# Altium schematic sheet SAST_PCB_V2B_Test_Beta_Sensors.SchDoc
size A2; SheetNumber: 1; SheetTotal: 1
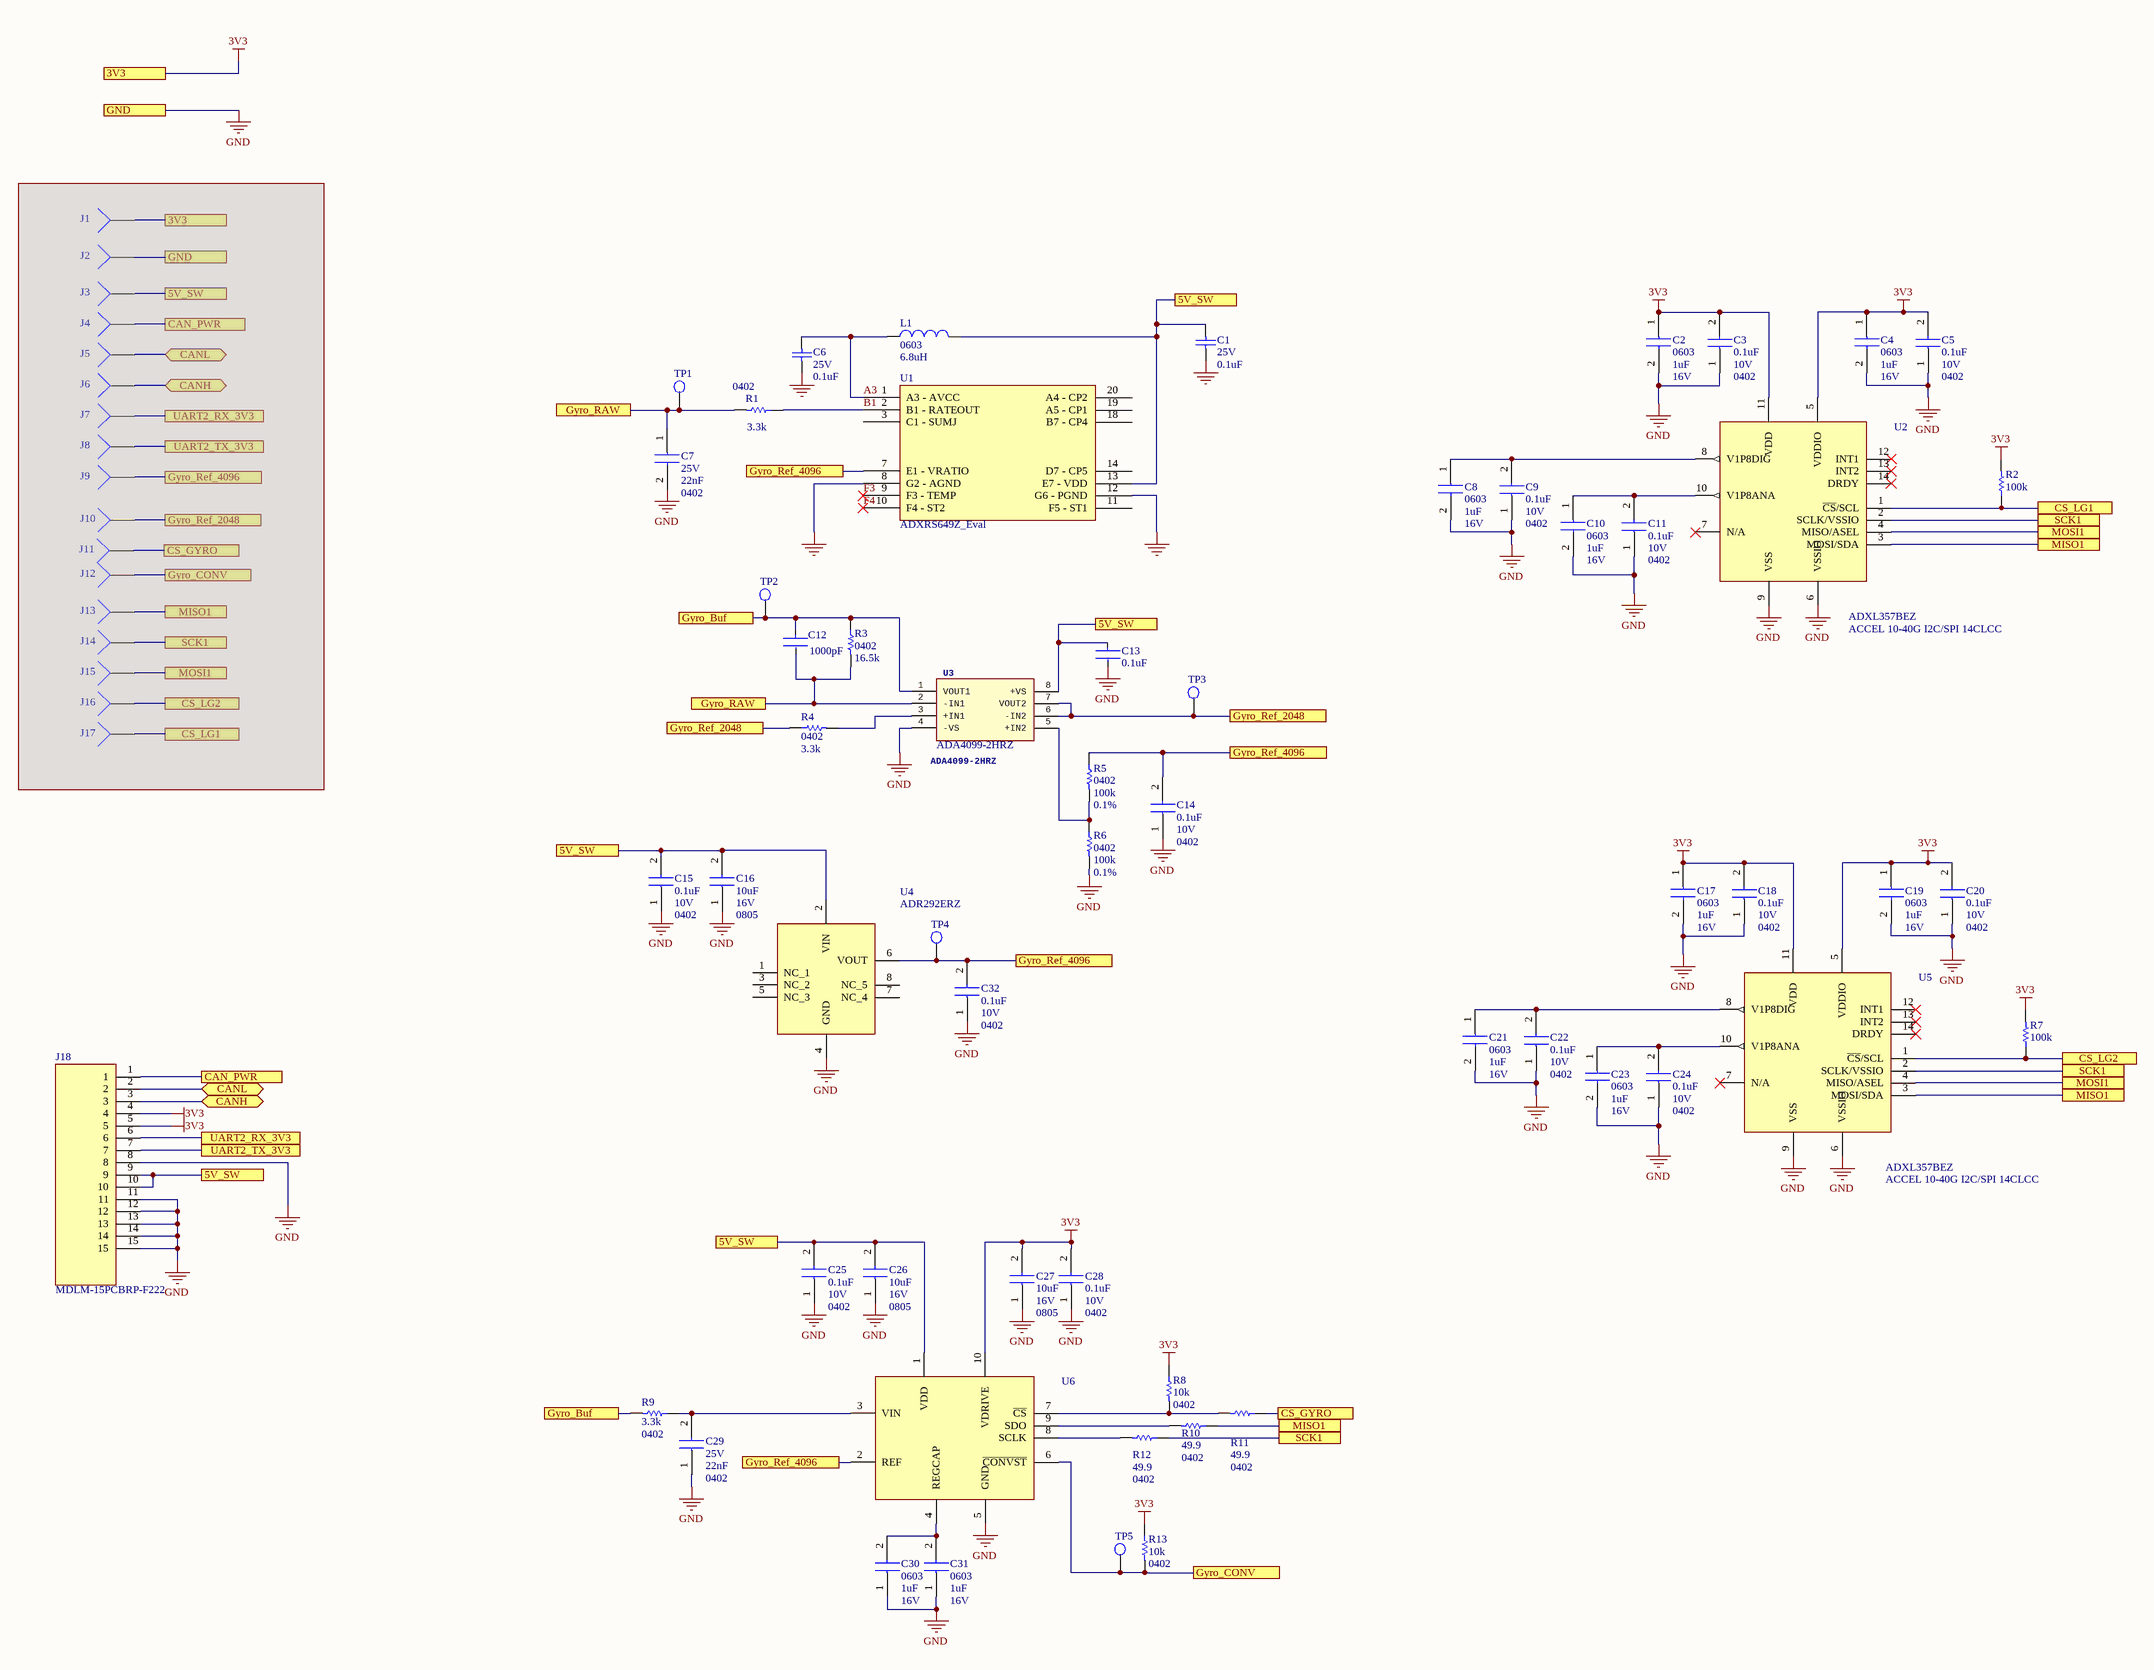
[diagram p0: SAST_PCB_V2B_Test_Beta_Sensors.SchDoc]

## Parts
C1  25V  value 0.1uF  [0402_DSP]
C2  value 1uF  Case/Package: 0603  Voltage: 16V  [0603_DSP]  (hidden comment: CAP CER 1UF 16V X8L 0603)
C3  value 0.1uF  Voltage: 10V  Case/Package: 0402  [0402_DSP]  (hidden comment: CAP CER .1UF 10V X8M 0201)
C4  value 1uF  Case/Package: 0603  Voltage: 16V  [0603_DSP]  (hidden comment: CAP CER 1UF 16V X8L 0603)
C5  value 0.1uF  Voltage: 10V  Case/Package: 0402  [0402_DSP]  (hidden comment: CAP CER .1UF 10V X8M 0201)
C6  25V  value 0.1uF  [0402_DSP]
C7  value 22nF  Voltage: 25V  Case/Package: 0402  [0402_DSP]  (hidden comment: CAP CER 0.022UF 25V X8R 0402)
C8  value 1uF  Case/Package: 0603  Voltage: 16V  [0603_DSP]  (hidden comment: CAP CER 1UF 16V X8L 0603)
C9  value 0.1uF  Voltage: 10V  Case/Package: 0402  [0402_DSP]  (hidden comment: CAP CER .1UF 10V X8M 0201)
C10  value 1uF  Case/Package: 0603  Voltage: 16V  [0603_DSP]  (hidden comment: CAP CER 1UF 16V X8L 0603)
C11  value 0.1uF  Voltage: 10V  Case/Package: 0402  [0402_DSP]  (hidden comment: CAP CER .1UF 10V X8M 0201)
C12  value 1000pF  [FP-GCM155-0_05-IPC_B]  (hidden comment: GCM155L81E104KE02D)
C13  value 0.1uF  [FP-GCM155-0_05-IPC_B]  (hidden comment: GCM155L81E104KE02D)
C14  value 0.1uF  Voltage: 10V  Case/Package: 0402  [0402_DSP]  (hidden comment: CAP CER .1UF 10V X8M 0201)
C15  value 0.1uF  Voltage: 10V  Case/Package: 0402  [0402_DSP]  (hidden comment: CAP CER .1UF 10V X8M 0201)
C16  value 10uF  Voltage: 16V  Case/Package: 0805  [CAPC2012X140N]  (hidden comment: CAP CER 10UF 16V X8M 0805)
C17  value 1uF  Case/Package: 0603  Voltage: 16V  [0603_DSP]  (hidden comment: CAP CER 1UF 16V X8L 0603)
C18  value 0.1uF  Voltage: 10V  Case/Package: 0402  [0402_DSP]  (hidden comment: CAP CER .1UF 10V X8M 0201)
C19  value 1uF  Case/Package: 0603  Voltage: 16V  [0603_DSP]  (hidden comment: CAP CER 1UF 16V X8L 0603)
C20  value 0.1uF  Voltage: 10V  Case/Package: 0402  [0402_DSP]  (hidden comment: CAP CER .1UF 10V X8M 0201)
C21  value 1uF  Case/Package: 0603  Voltage: 16V  [0603_DSP]  (hidden comment: CAP CER 1UF 16V X8L 0603)
C22  value 0.1uF  Voltage: 10V  Case/Package: 0402  [0402_DSP]  (hidden comment: CAP CER .1UF 10V X8M 0201)
C23  value 1uF  Case/Package: 0603  Voltage: 16V  [0603_DSP]  (hidden comment: CAP CER 1UF 16V X8L 0603)
C24  value 0.1uF  Voltage: 10V  Case/Package: 0402  [0402_DSP]  (hidden comment: CAP CER .1UF 10V X8M 0201)
C25  value 0.1uF  Voltage: 10V  Case/Package: 0402  [0402_DSP]  (hidden comment: CAP CER .1UF 10V X8M 0201)
C26  value 10uF  Voltage: 16V  Case/Package: 0805  [CAPC2012X140N]  (hidden comment: CAP CER 10UF 16V X8M 0805)
C27  value 10uF  Voltage: 16V  Case/Package: 0805  [CAPC2012X140N]  (hidden comment: CAP CER 10UF 16V X8M 0805)
C28  value 0.1uF  Voltage: 10V  Case/Package: 0402  [0402_DSP]  (hidden comment: CAP CER .1UF 10V X8M 0201)
C29  value 22nF  Voltage: 25V  Case/Package: 0402  [0402_DSP]  (hidden comment: CAP CER 0.022UF 25V X8R 0402)
C30  value 1uF  Case/Package: 0603  Voltage: 16V  [0603_DSP]  (hidden comment: CAP CER 1UF 16V X8L 0603)
C31  value 1uF  Case/Package: 0603  Voltage: 16V  [0603_DSP]  (hidden comment: CAP CER 1UF 16V X8L 0603)
C32  value 0.1uF  Voltage: 10V  Case/Package: 0402  [0402_DSP]  (hidden comment: CAP CER .1UF 10V X8M 0201)
J1  (no value)  [Wire24Awg2x1HPAD]
J2  (no value)  [Wire24Awg2x1HPAD]
J3  (no value)  [Wire24Awg2x1HPAD]
J4  (no value)  [Wire24Awg2x1HPAD]
J5  (no value)  [Wire24Awg2x1HPAD]
J6  (no value)  [Wire24Awg2x1HPAD]
J7  (no value)  [Wire24Awg2x1HPAD]
J8  (no value)  [Wire24Awg2x1HPAD]
J9  (no value)  [Wire24Awg2x1HPAD]
J10  (no value)  [Wire24Awg2x1HPAD]
J11  (no value)  [Wire24Awg2x1HPAD]
J12  (no value)  [Wire24Awg2x1HPAD]
J13  (no value)  [Wire24Awg2x1HPAD]
J14  (no value)  [Wire24Awg2x1HPAD]
J15  (no value)  [Wire24Awg2x1HPAD]
J16  (no value)  [Wire24Awg2x1HPAD]
J17  (no value)  [Wire24Awg2x1HPAD]
J18  MDLM-15PCBRP-F222  [MDLM-15PCBRP-F222]
L1  value 6.8uH  PackageReference: 0603  [0603_DSP]  (hidden comment: Inductor)
R1  value 3.3k  Case/Package: 0402  [0402_DSP]
R2  value 100k  [0402_DSP]
R3  0402  value 16.5k  [0402_DSP]
R4  0402  value 3.3k  [0402_DSP]
R5  0402  value 100k  Tolerance: 0.1%  [0402_DSP]
R6  0402  value 100k  Tolerance: 0.1%  [0402_DSP]
R7  value 100k  [0402_DSP]
R8  value 10k  Case/Package: 0402  [0402_DSP]
R9  value 3.3k  Case/Package: 0402  [0402_DSP]
R10  value 49.9  Case/Package: 0402  [0402_DSP]
R11  value 49.9  Case/Package: 0402  [0402_DSP]
R12  value 49.9  Case/Package: 0402  [0402_DSP]
R13  value 10k  Case/Package: 0402  [0402_DSP]
TP1  (no value)  [TestPoint_4952]
TP2  (no value)  [TestPoint_4952]
TP3  (no value)  [TestPoint_4952]
TP4  (no value)  [TestPoint_4952]
TP5  (no value)  [TestPoint_4952]
U1  ADXRS649Z_Eval  [ADXRS649Z_Eval]
U2  ACCEL 10-40G I2C/SPI 14CLCC  [ADXL355BEZ]
U3  ADA4099-2HRZ  [SOIC127P600X175-8N]
U4  ADR292ERZ  [SOIC127P600X175-8N]
U5  ACCEL 10-40G I2C/SPI 14CLCC  [ADXL355BEZ]
U6  IC ADC 12BIT SAR 10MSOP  [SOP50P490X110-10N]  (value not drawn)

## Ports
3V3 (see SAST_PCB_V2B_Test_Beta_Sensors[1A]), 5V_SW (see SAST_PCB_V2B_Test_Beta_Sensors[1A], SAST_PCB_V2B_Test_Beta_Sensors[1C], SAST_PCB_V2B_Test_Beta_Sensors[2B], SAST_PCB_V2B_Test_Beta_Sensors[3C], SAST_PCB_V2B_Test_Beta_Sensors[4A]), 5V_SW (see SAST_PCB_V2B_Test_Beta_Sensors[1A], SAST_PCB_V2B_Test_Beta_Sensors[1C], SAST_PCB_V2B_Test_Beta_Sensors[2B], SAST_PCB_V2B_Test_Beta_Sensors[3C], SAST_PCB_V2B_Test_Beta_Sensors[4B]), 5V_SW (see SAST_PCB_V2B_Test_Beta_Sensors[1A], SAST_PCB_V2B_Test_Beta_Sensors[1C], SAST_PCB_V2B_Test_Beta_Sensors[2B], SAST_PCB_V2B_Test_Beta_Sensors[4A], SAST_PCB_V2B_Test_Beta_Sensors[4B]), 5V_SW (see SAST_PCB_V2B_Test_Beta_Sensors[1A], SAST_PCB_V2B_Test_Beta_Sensors[1C], SAST_PCB_V2B_Test_Beta_Sensors[3C], SAST_PCB_V2B_Test_Beta_Sensors[4A], SAST_PCB_V2B_Test_Beta_Sensors[4B]), 5V_SW (see SAST_PCB_V2B_Test_Beta_Sensors[1A], SAST_PCB_V2B_Test_Beta_Sensors[2B], SAST_PCB_V2B_Test_Beta_Sensors[3C], SAST_PCB_V2B_Test_Beta_Sensors[4A], SAST_PCB_V2B_Test_Beta_Sensors[4B]), 5V_SW (see SAST_PCB_V2B_Test_Beta_Sensors[1C], SAST_PCB_V2B_Test_Beta_Sensors[2B], SAST_PCB_V2B_Test_Beta_Sensors[3C], SAST_PCB_V2B_Test_Beta_Sensors[4A], SAST_PCB_V2B_Test_Beta_Sensors[4B]), CAN_PWR (see SAST_PCB_V2B_Test_Beta_Sensors[1A]), CAN_PWR (see SAST_PCB_V2B_Test_Beta_Sensors[1C]), CANH (bidir, see SAST_PCB_V2B_Test_Beta_Sensors[1A]), CANH (bidir, see SAST_PCB_V2B_Test_Beta_Sensors[1C]), CANL (bidir, see SAST_PCB_V2B_Test_Beta_Sensors[1A]), CANL (bidir, see SAST_PCB_V2B_Test_Beta_Sensors[1C]), CS_GYRO (see SAST_PCB_V2B_Test_Beta_Sensors[1B]), CS_GYRO (see SAST_PCB_V2B_Test_Beta_Sensors[4D]), CS_LG1 (see SAST_PCB_V2B_Test_Beta_Sensors[1B]), CS_LG1 (see SAST_PCB_V2B_Test_Beta_Sensors[7B]), CS_LG2 (see SAST_PCB_V2B_Test_Beta_Sensors[1B]), CS_LG2 (see SAST_PCB_V2B_Test_Beta_Sensors[7C]), GND (see SAST_PCB_V2B_Test_Beta_Sensors[1A]), Gyro_Buf (see SAST_PCB_V2B_Test_Beta_Sensors[2D]), Gyro_Buf (see SAST_PCB_V2B_Test_Beta_Sensors[3B]), Gyro_CONV (see SAST_PCB_V2B_Test_Beta_Sensors[1B]), Gyro_CONV (see SAST_PCB_V2B_Test_Beta_Sensors[4D]), Gyro_RAW (see SAST_PCB_V2B_Test_Beta_Sensors[2B]), Gyro_RAW (see SAST_PCB_V2B_Test_Beta_Sensors[3B]), Gyro_Ref_2048 (see SAST_PCB_V2B_Test_Beta_Sensors[1B], SAST_PCB_V2B_Test_Beta_Sensors[3B]), Gyro_Ref_2048 (see SAST_PCB_V2B_Test_Beta_Sensors[1B], SAST_PCB_V2B_Test_Beta_Sensors[4B]), Gyro_Ref_2048 (see SAST_PCB_V2B_Test_Beta_Sensors[3B], SAST_PCB_V2B_Test_Beta_Sensors[4B]), Gyro_Ref_4096 (see SAST_PCB_V2B_Test_Beta_Sensors[1B], SAST_PCB_V2B_Test_Beta_Sensors[3B], SAST_PCB_V2B_Test_Beta_Sensors[3D], SAST_PCB_V2B_Test_Beta_Sensors[4B]), Gyro_Ref_4096 (see SAST_PCB_V2B_Test_Beta_Sensors[1B], SAST_PCB_V2B_Test_Beta_Sensors[3B], SAST_PCB_V2B_Test_Beta_Sensors[3D], SAST_PCB_V2B_Test_Beta_Sensors[4C]), Gyro_Ref_4096 (see SAST_PCB_V2B_Test_Beta_Sensors[1B], SAST_PCB_V2B_Test_Beta_Sensors[3B], SAST_PCB_V2B_Test_Beta_Sensors[4B], SAST_PCB_V2B_Test_Beta_Sensors[4C]), Gyro_Ref_4096 (see SAST_PCB_V2B_Test_Beta_Sensors[1B], SAST_PCB_V2B_Test_Beta_Sensors[3D], SAST_PCB_V2B_Test_Beta_Sensors[4B], SAST_PCB_V2B_Test_Beta_Sensors[4C]), Gyro_Ref_4096 (see SAST_PCB_V2B_Test_Beta_Sensors[3B], SAST_PCB_V2B_Test_Beta_Sensors[3D], SAST_PCB_V2B_Test_Beta_Sensors[4B], SAST_PCB_V2B_Test_Beta_Sensors[4C]), MISO1 (see SAST_PCB_V2B_Test_Beta_Sensors[1B], SAST_PCB_V2B_Test_Beta_Sensors[4D], SAST_PCB_V2B_Test_Beta_Sensors[7B]), MISO1 (see SAST_PCB_V2B_Test_Beta_Sensors[1B], SAST_PCB_V2B_Test_Beta_Sensors[4D], SAST_PCB_V2B_Test_Beta_Sensors[7C]), MISO1 (see SAST_PCB_V2B_Test_Beta_Sensors[1B], SAST_PCB_V2B_Test_Beta_Sensors[7B], SAST_PCB_V2B_Test_Beta_Sensors[7C]), MISO1 (see SAST_PCB_V2B_Test_Beta_Sensors[4D], SAST_PCB_V2B_Test_Beta_Sensors[7B], SAST_PCB_V2B_Test_Beta_Sensors[7C]), MOSI1 (see SAST_PCB_V2B_Test_Beta_Sensors[1B], SAST_PCB_V2B_Test_Beta_Sensors[7B]), MOSI1 (see SAST_PCB_V2B_Test_Beta_Sensors[1B], SAST_PCB_V2B_Test_Beta_Sensors[7C]), MOSI1 (see SAST_PCB_V2B_Test_Beta_Sensors[7B], SAST_PCB_V2B_Test_Beta_Sensors[7C]), SCK1 (see SAST_PCB_V2B_Test_Beta_Sensors[1B], SAST_PCB_V2B_Test_Beta_Sensors[4D], SAST_PCB_V2B_Test_Beta_Sensors[7B]), SCK1 (see SAST_PCB_V2B_Test_Beta_Sensors[1B], SAST_PCB_V2B_Test_Beta_Sensors[4D], SAST_PCB_V2B_Test_Beta_Sensors[7C]), SCK1 (see SAST_PCB_V2B_Test_Beta_Sensors[1B], SAST_PCB_V2B_Test_Beta_Sensors[7B], SAST_PCB_V2B_Test_Beta_Sensors[7C]), SCK1 (see SAST_PCB_V2B_Test_Beta_Sensors[4D], SAST_PCB_V2B_Test_Beta_Sensors[7B], SAST_PCB_V2B_Test_Beta_Sensors[7C]), UART2_RX_3V3 (see SAST_PCB_V2B_Test_Beta_Sensors[1B]), UART2_RX_3V3 (see SAST_PCB_V2B_Test_Beta_Sensors[1C]), UART2_TX_3V3 (see SAST_PCB_V2B_Test_Beta_Sensors[1B]), UART2_TX_3V3 (see SAST_PCB_V2B_Test_Beta_Sensors[1C])

## Nets
3V3: C2.1 C3.2 C4.1 C5.2 C17.1 C18.2 C19.1 C20.2 C27.2 C28.2 J1.1 J18.4 J18.5 R2.2 R7.2 R8.1 R13.1 U2.5(VDDIO) U2.11(VDD) U5.5(VDDIO) U5.11(VDD) U6.10(VDRIVE) ; port 3V3
GND: C1.1 C2.2 C3.1 C4.2 C5.1 C6.1 C7.2 C8.2 C9.1 C10.2 C11.1 C13.2 C14.1 C15.1 C16.1 C17.2 C18.1 C19.2 C20.1 C21.2 C22.1 C23.2 C24.1 C25.1 C26.1 C27.1 C28.1 C29.1 C30.1 C31.1 C32.1 J2.1 J18.8 J18.11 J18.12 J18.13 J18.14 J18.15 R6.2 U1.8(G2_-_AGND) U1.12(G6_-_PGND) U2.6(VSSIO) U2.9(VSS) U3.4(-VS) U4.4(GND) U5.6(VSSIO) U5.9(VSS) U6.5(GND) ; port GND
5V_SW: C1.2 C13.1 C15.2 C16.2 C25.2 C26.2 J3.1 J18.9 J18.10 L1.2 U1.13(E7_-_VDD) U3.8(+VS) U4.2(VIN) U6.1(VDD) ; port 5V_SW
A3: C6.2 L1.1 U1.1(A3_-_AVCC)
B1: R1.1 U1.2(B1_-_RATEOUT)
CAN_PWR: J4.1 J18.1 ; port CAN_PWR
CANH: J6.1 J18.3 ; port CANH
CANL: J5.1 J18.2 ; port CANL
CS_GYRO: J11.1 R11.1 ; port CS_GYRO
CS_LG1: J17.1 R2.1 U2.1(~{CS}/SCL) ; port CS_LG1
CS_LG2: J16.1 R7.1 U5.1(~{CS}/SCL) ; port CS_LG2
F3: U1.9(F3_-_TEMP)
F4: U1.10(F4_-_ST2)
Gyro_Buf: C12.1 R3.1 R9.2 TP2.1 U3.1(VOUT1) ; port Gyro_Buf
Gyro_CONV: J12.1 R13.2 TP5.1 U6.6(~{CONVST}) ; port Gyro_CONV
Gyro_RAW: C7.1 C12.2 R1.2 R3.2 TP1.1 U3.2(-IN1) ; port Gyro_RAW
Gyro_Ref_2048: J10.1 R4.1 TP3.1 U3.6(-IN2) U3.7(VOUT2) ; port Gyro_Ref_2048
Gyro_Ref_4096: C14.2 C32.2 J9.1 R5.1 TP4.1 U1.7(E1_-_VRATIO) U4.6(VOUT) U6.2(REF) ; port Gyro_Ref_4096
MISO1: J13.1 R10.1 U2.3(MOSI/SDA) U5.3(MOSI/SDA) ; port MISO1
MOSI1: J15.1 U2.4(MISO/ASEL) U5.4(MISO/ASEL) ; port MOSI1
SCK1: J14.1 R12.1 U2.2(SCLK/VSSIO) U5.2(SCLK/VSSIO) ; port SCK1
UART2_RX_3V3: J7.1 J18.6 ; port UART2_RX_3V3
UART2_TX_3V3: J8.1 J18.7 ; port UART2_TX_3V3
NetC8_1: C8.1 C9.2 U2.8(V1P8DIG)
NetC10_1: C10.1 C11.2 U2.10(V1P8ANA)
NetC21_1: C21.1 C22.2 U5.8(V1P8DIG)
NetC23_1: C23.1 C24.2 U5.10(V1P8ANA)
NetC29_2: C29.2 R9.1 U6.3(VIN)
NetC30_2: C30.2 C31.2 U6.4(REGCAP)
NetR4_2: R4.2 U3.3(+IN1)
NetR5_2: R5.2 R6.1 U3.5(+IN2)
NetR8_2: R8.2 R11.2 U6.7(~{CS})
NetR10_2: R10.2 U6.9(SDO)
NetR12_2: R12.2 U6.8(SCLK)

Not connected (* = marked no-connect by the designer): U1 3(C1_-_SUMJ) 11(F5_-_ST1) 14(D7_-_CP5) 18(B7_-_CP4) 19(A5_-_CP1) 20(A4_-_CP2); U2 7(N/A)* 12(INT1)* 13(INT2)* 14(DRDY)*; U4 1(NC_1) 3(NC_2) 5(NC_3) 7(NC_4) 8(NC_5); U5 7(N/A)* 12(INT1)* 13(INT2)* 14(DRDY)*

## Library data of the parts
C1 C6 = Cap: Capacitor; Published: 8-Jun-2000; LatestRevisionDate: 17-Jul-2002; LatestRevisionNote: Re-released for DXP Platform.; PackageReference: RAD-0.3; Publisher: Altium Limited; PackageDescription: Radial Cap, Thru-Hole; 2 Leads; 0.3 in Pin Spacing
C2 C4 C8 C10 C17 C19 C21 C23 C30 C31 = GCG188L8EE105KA07D: Capacitor: 1 µF ±10% 16V Ceramic Capacitor X8L 0603; Manufacturer_Name: Murata Electronics; Datasheet Link: https://psearch.en.murata.com/capacitor/product/GCG188L8EE105KA07%23.html; Height: 0.9mm; Manufacturer_Part_Number: GCG188L8EE105KA07D; Mouser Part Number: 81-GCG188L8EE105KA7D; Mouser Price/Stock: https://www.mouser.co.uk/ProductDetail/Murata-Electronics/GCG188L8EE105KA07D?qs=rrS6PyfT74dFMfTR80dVTA%3D%3D; Arrow Part Number: GCG188L8EE105KA07D; Arrow Price/Stock: https://www.arrow.com/en/products/gcg188l8ee105ka07d/murata-manufacturing
C3 C5 C9 C11 C14 C15 C18 C20 C22 C24 C25 C28 C32 = GCM033M8ED104KE07J: Capacitor: 0.1 µF ±10% 10V Ceramic Capacitor X8M 0201; Manufacturer_Name: Murata Electronics; Datasheet Link: https://search.murata.co.jp/Ceramy/image/img/A01X/G101/ENG/GCM033M8ED104KE07-01A.pdf; Height: 0.33mm; Manufacturer_Part_Number: GCM033M8ED104KE07J; Mouser Part Number: 81-GCM033M8ED104KE07; Mouser Price/Stock: https://www.mouser.co.uk/ProductDetail/Murata-Electronics/GCM033M8ED104KE07J?qs=xZFQr2mActesc5d29hjXRw%3D%3D
C7 C29 = C1005X8R1E223K050BB: Capacitor: 0.022 µF ±10% 25V Ceramic Capacitor X8R 0402 (1005 Metric); Manufacturer_Name: TDK; Datasheet Link: https://product.tdk.com/info/en/catalog/datasheets/mlcc_commercial_midvoltage_en.pdf; Height: 0.55mm; Manufacturer_Part_Number: C1005X8R1E223K050BB
C12 = CMP-06035-044163-1: Ceramic Capacitor for Automotive 100nF ±10% 25VDC X8L 0402 Paper T/R; Manufacturer_Name: Murata Electronics; Voltage: 25V; Manufacturer_Part_Number: GCM155L81E104KE02D; Supplier_Name: Mouser; Supplier_Part_Number: 81-GCM155L81E104KE2D
C13 = CMP-06035-044163-1: Ceramic Capacitor for Automotive 100nF ±10% 25VDC X8L 0402 Paper T/R; Manufacturer_Name: Murata Electronics; Voltage: 25V; Picture: CAP_0.1uF; Manufacturer_Part_Number: GCM155L81E104KE02D; Supplier_Name: Mouser; Supplier_Part_Number: 81-GCM155L81E104KE2D
C16 C26 C27 = GCM21BM8EE106KE08L: Capacitor:  10 µF ±10% 16V Ceramic Capacitor X8M 0805 (2012 Metric); Manufacturer_Name: Murata Electronics; Datasheet Link: https://psearch.en.murata.com/capacitor/product/GCM21BM8EE106KE08%23.html; Height: 1.4mm; Manufacturer_Part_Number: GCM21BM8EE106KE08L; Mouser Part Number: 81-GCM21BM8EE106KE8L; Mouser Price/Stock: https://www.mouser.co.uk/ProductDetail/Murata-Electronics/GCM21BM8EE106KE08L?qs=rrS6PyfT74fl6X5LUXfufw%3D%3D; Arrow Part Number: GCM21BM8EE106KE08L; Arrow Price/Stock: https://www.arrow.com/en/products/gcm21bm8ee106ke08l/murata-manufacturing?region=nac
J1-J17 = Socket: LatestRevisionDate: 17-Jul-2002; LatestRevisionNote: Re-released for DXP Platform.; Publisher: Altium Limited
J18 = MDLM-15PCBRP-F222: Connector; Manufacturer_Name: ITT CANNON; Height: 0.250; Manufacturer_Part_Number: MDLM-15PCBRP-F222
L1 = Inductor: Code_IEC: 1005; Published: 8-Jun-2000; LatestRevisionDate: 29-May-2009; LatestRevisionNote: IPC-7351 Footprint Added.; Publisher: Altium Limited; PackageDescription: Chip Inductor; Code_JEITA: 0402
R1 R3 R9 = Resistor 0402: Manufacturer_Name: Vishay / Dale; Manufacturer_Part_Number: CRCW04023K30FKEDC; Supplier_Name: Mouser; Supplier_Part_Number: 71-CRCW04023K30FKEDC; Voltage: *
R2 R7 = Resistor 0402: Manufacturer_Name: Vishay / Dale; Manufacturer_Part_Number: CRCW0402100KFKEDC; Supplier_Name: Mouser; Supplier_Part_Number: 71-CRCW0402100KFKEDC; Voltage: *
R4 = Res1: Resistor; Published: 8-Jun-2000; LatestRevisionDate: 17-Jul-2002; LatestRevisionNote: Re-released for DXP Platform.; PackageReference: AXIAL-0.3; Publisher: Altium Limited; PackageDescription: Axial Device, Thru-Hole; 2 Leads; 0.3 in Pin Spacing
R5 R6 R10-R12 = Resistor 0402: Manufacturer_Name: Vishay / Dale; Supplier_Name: Mouser; Voltage: *
R8 R13 = Resistor 0402: Manufacturer_Name: Vishay / Dale; Manufacturer_Part_Number: CRCW040210K0FKEDC; Supplier_Name: Mouser; Supplier_Part_Number: 71-CRCW040210K0FKEDC; Voltage: *
TP1-TP5 = Test_Point: Mouser_part_number: 534-4952
U2 U5 = ADXL357BEZ: Integrated Circuit:Accelerometer X, Y, Z Axis ±10g, ±20g, ±40g 1Hz ~ 1kHz 14-CLCC (6x6); Manufacturer_Name: Analog Devices; Datasheet Link: https://componentsearchengine.com/Datasheets/2/ADXL357BEZ.pdf; Height: 2.25mm; Manufacturer_Part_Number: ADXL357BEZ; Mouser Part Number: 584-ADXL357BEZ; Mouser Price/Stock: https://www.mouser.co.uk/ProductDetail/Analog-Devices/ADXL357BEZ?qs=JxTdDJPFbyK%252BcMwBtm6iZg%3D%3D; Arrow Part Number: ADXL357BEZ; Arrow Price/Stock: https://www.arrow.com/en/products/adxl357bez/analog-devices?region=asia
U3 = ADA4099-2HRZ: Manufacturer_Name: Analog Devices; GateName_1: G$1; SymbolName_1: ADA4099-2HRZ; DeviceSetName: ADA4099-2HRZ; Supplier_Part_Number: 584-ADA4099-2HRZ; Manufacturer_Part_Number: ADA4099-2HRZ; Height: 1.75mm; Supplier_Name: Mouser; LibraryName: ADA4099-2HRZ
U4 = ADR292ERZ: Voltage Reference 4.096V, (input min 4.4V); Manufacturer_Name: Analog Devices; Datasheet Link: http://www.analog.com/static/imported-files/data_sheets/ADR291_292.pdf; Height: 1.75mm; Manufacturer_Part_Number: ADR292ERZ; Mouser Part Number: 584-ADR292ERZ; Mouser Price/Stock: https://www.mouser.co.uk/ProductDetail/Analog-Devices/ADR292ERZ?qs=WIvQP4zGanjFAAEqrXyPZQ%3D%3D; Arrow Part Number: ADR292ERZ; Arrow Price/Stock: https://www.arrow.com/en/products/adr292erz/analog-devices?region=nac
U6 = AD7091RBRMZ: Integrated Circuit:12 Bit Analog to Digital Converter 1 Input 1 SAR 10-MSOP; Manufacturer_Name: Analog Devices; Datasheet Link: https://componentsearchengine.com/Datasheets/1/AD7091RBRMZ.pdf; Height: 1.1mm; Manufacturer_Part_Number: AD7091RBRMZ; Mouser Part Number: 584-AD7091RBRMZ; Mouser Price/Stock: https://www.mouser.co.uk/ProductDetail/Analog-Devices/AD7091RBRMZ?qs=NmRFExCfTkFn%252B92PbnlqTA%3D%3D; Arrow Part Number: AD7091RBRMZ; Arrow Price/Stock: https://www.arrow.com/en/products/ad7091rbrmz/analog-devices?region=nac